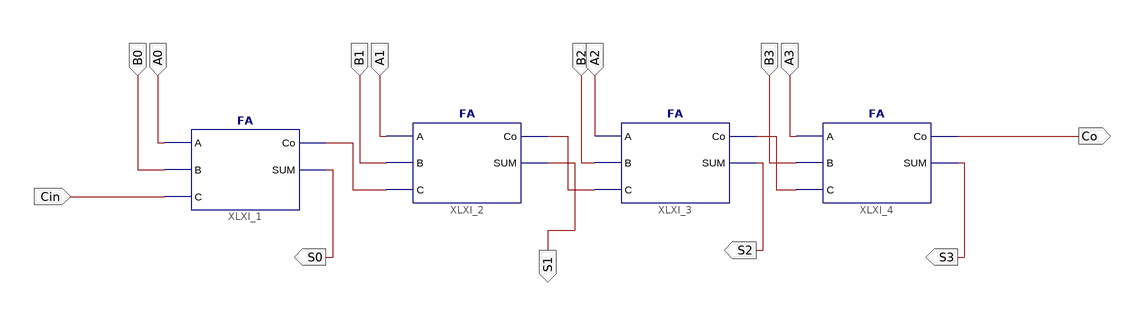
[diagram p0: schematic sheet 1]
// Xilinx ISE schematic fourbitbinaryadder.sch (artix7) as structural Verilog: 4 symbols, 14 ports
module fourbitbinaryadder (
  input  Cin,
  input  A0,
  input  B0,
  input  A1,
  input  B1,
  input  B2,
  input  A3,
  input  B3,
  input  A2,
  output Co,
  output S0,
  output S1,
  output S2,
  output S3
);

  wire XLXN_3, XLXN_4, XLXN_5;

  FA XLXI_1 (.A(A0), .B(B0), .C(Cin), .Co(XLXN_5), .SUM(S0));
  FA XLXI_2 (.A(A1), .B(B1), .C(XLXN_5), .Co(XLXN_4), .SUM(S1));
  FA XLXI_3 (.A(A2), .B(B2), .C(XLXN_4), .Co(XLXN_3), .SUM(S2));
  FA XLXI_4 (.A(A3), .B(B3), .C(XLXN_3), .Co(Co), .SUM(S3));
endmodule
